# Altium schematic sheet USB.SchDoc: USB
size A4; Organization: Use Organization_Name in ProjParam; Address1: Eliot Ferragni; Address2: STI-MOBOTS; Address3: EPFL; Address4: CH-1015 LAUSANNE; DocumentNumber: 3; Revision: A; SheetNumber: 3; SheetTotal: 7; ApprovedBy: Init ApprovedBy in DocParam; CheckedBy: Init CheckedBy in DocParam; Author: Init Author in DocParam; CompanyName: Init CompanyName in DocParam; DrawnBy: Init DrawBy in DocParam; Engineer: Init Engineer in DocParam; Title2: USB-C connector, ESD protections and PD controller; DocumentName: Init DocumentName in DocParam; ProjectName: Init ProjectName in DocParam
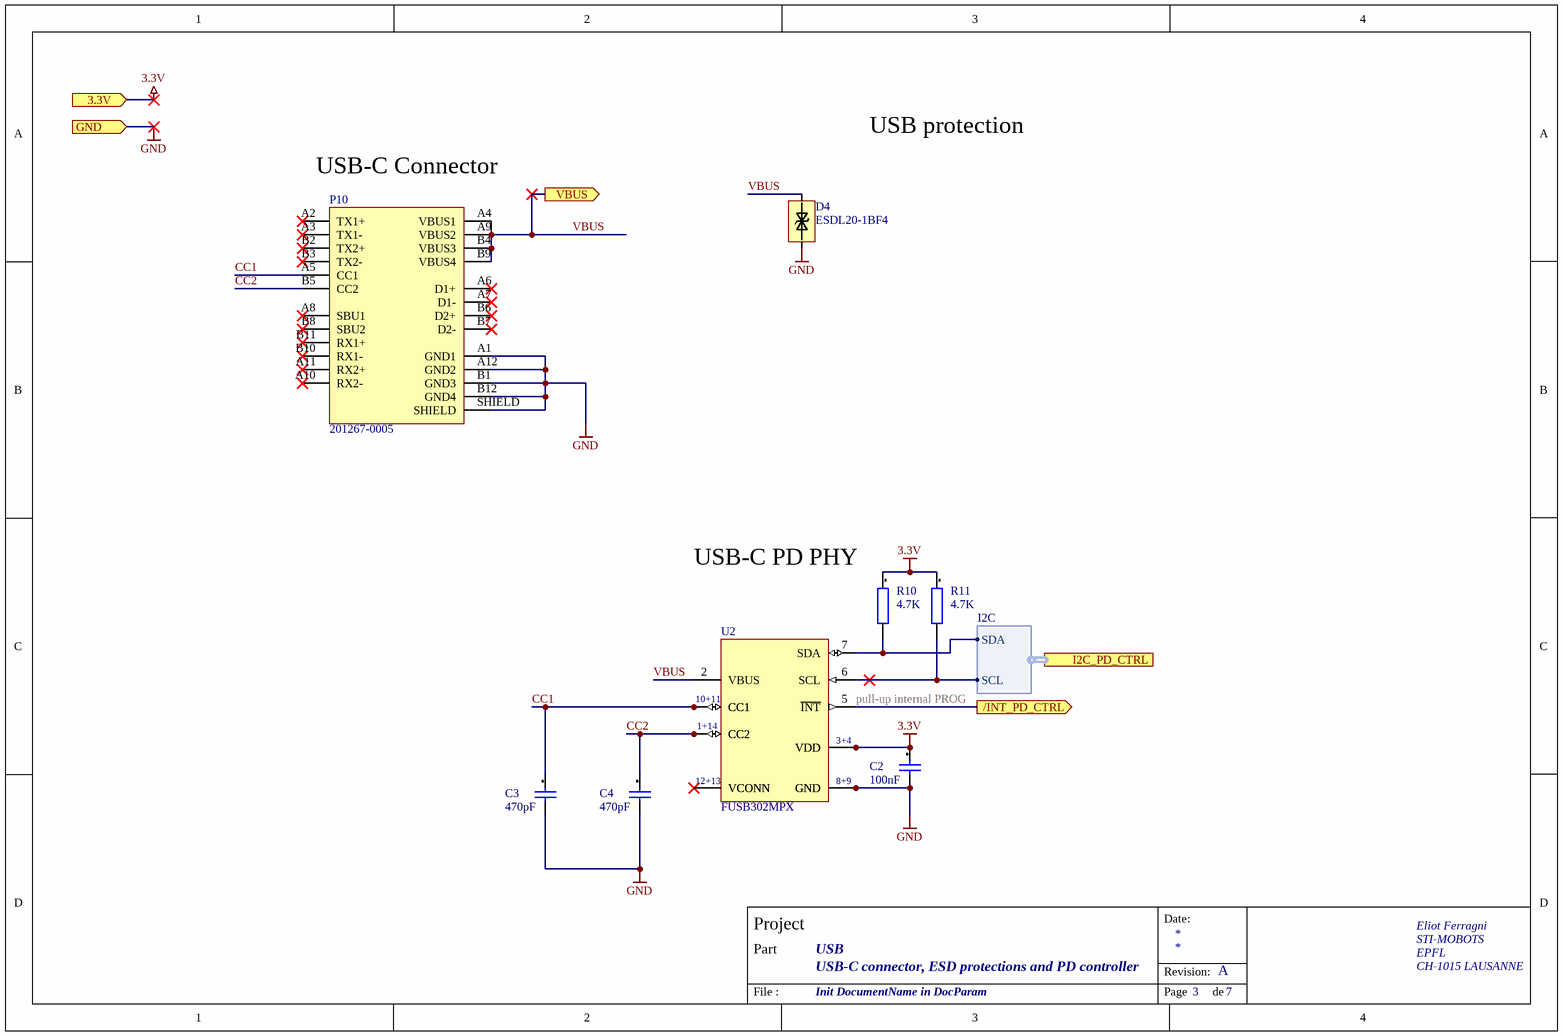
[diagram p0: USB.SchDoc]

## Parts
C2  100nF  [CAPC1608X08L]
C3  470pF  [CAPC1608X08L]
C4  470pF  [CAPC1608X08L]
D4  ESDL20-1BF4  [0201 USB protection diodes]
P10  201267-0005  [MOLEX_2012670005]
R10  4.7K  [RESC1608X06N]
R11  4.7K  [RESC1608X06N]
U2  FUSB302MPX  [PQFN50P250X250X60_HS-15L]

## Ports
3.3V (in), /INT_PD_CTRL (out), GND (in), I2C_PD_CTRL (harness I2C), VBUS (out)

## Harnesses
I2C: SDA, SCL

## Nets
3.3V: C2.1 R10.1 R11.1 U2.3(VDD) U2.4(VDD) ; port 3.3V
GND: C2.2 C3.2 C4.2 D4.2 P10.A1(GND1) P10.A12(GND2) P10.B1(GND3) P10.B12(GND4) P10.SHIELD U2.8(GND) U2.9(GND) ; port GND
/INT_PD_CTRL: U2.5(~{INT}) ; port /INT_PD_CTRL
CC1: C3.1 P10.A5(CC1) U2.10(CC1) U2.11(CC1)
CC2: C4.1 P10.B5(CC2) U2.1(CC2) U2.14(CC2)
VBUS: D4.1 P10.A4(VBUS1) P10.A9(VBUS2) P10.B4(VBUS3) P10.B9(VBUS4) U2.2(VBUS) ; port VBUS
NetR10_2: R10.2 U2.7(SDA) ; port I2C_PD_CTRL.SDA
NetR11_2: R11.2 U2.6(SCL) ; port I2C_PD_CTRL.SCL
NetU2_12: U2.12(VCONN) U2.13(VCONN)

Not connected (* = marked no-connect by the designer): P10 A2(TX1+)* A3(TX1-)* A6(D1+)* A7(D1-)* A8(SBU1)* A10(RX2-)* A11(RX2+)* B2(TX2+)* B3(TX2-)* B6(D2+)* B7(D2-)* B8(SBU2)* B10(RX1-)* B11(RX1+)*

## Notes on the sheet
- (near P10) USB-C Connector
- USB protection
- (near R10) USB-C PD PHY
- (near U2) pull-up internal PROG
- Date:
- Project
- Part
- Revision:
- File :
- Page
- de
- (in symbol FUSB302MPX) 10+11; 1+14; 3+4; 12+13; 8+9

## Library data of the parts
C2-C4 = TBD Capacitor[[/\]]0603[[/\]]1: Capacitor TBD 0603; Preference: 1; Currentie: CHF; Size: 0603; Footprint Acort: 0603_G; ROHS: True; DateLastUpdate: 2012-11-19 / 14:36:40
P10 = 201267-0005: USB Shielded I/O Receptacle; Type C; Right Angle; Surface Mount; Gold over Nickel; Manufacturer: Molex; Supplier 1: Digi-Key; Stock 1: 7138; Pricing 1: 1=2.77, 10=2.531, 25=2.3876, 50=2.292, 100=2.1965, 250=2.00552, 500=1.86228 (USD); Supplier Part Number 1: WM17992CT-ND; Manufacturer Part Number: 201267-0005
R10 R11 = TBD[[/\]]0603[[/\]]1: Resistor ToDo 0603; Preference: 1; Currentie: CHF; Size: 0603; Footprint Acort: 0603; ROHS: True; DateLastUpdate: 2012-11-19 / 14:13:33
U2 = FUSB302MPX: USB Type-C Port Controller 9-Pin MLP T/R; Manufacturer: ON Semiconductor / Fairchild; Operating Supply Current: 25uA; Supplier 1: Digi-Key; Stock 1: 0; Mount: Surface Mount; Number of Pins: 14; Contact Plating: Copper,Silver,Tin; Min Operating Temperature: -40°C; Max Operating Temperature: 85°C; Packaging: Tape and Reel; Interface: USB; Lead Free: Lead Free; Supplier Part Number 1: FUSB302MPXTR-ND; Manufacturer Part Number: FUSB302MPX